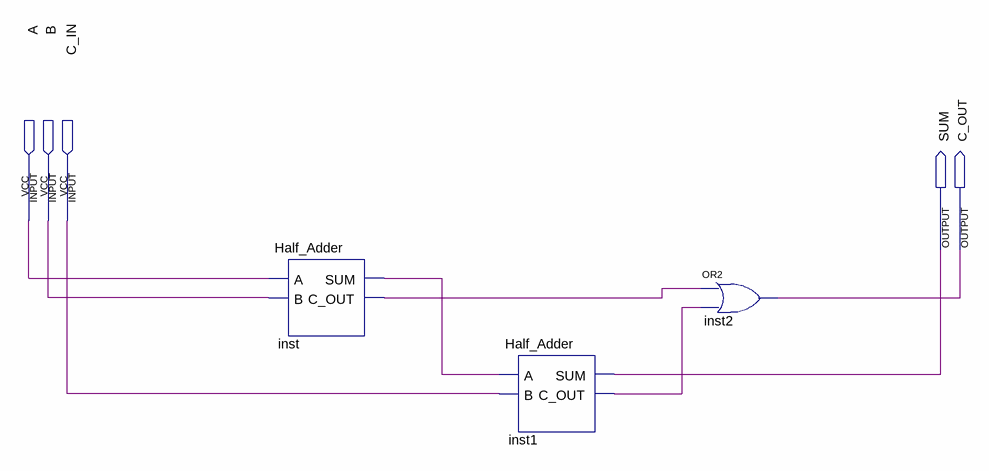
[diagram p0: schematic sheet]
// Quartus schematic Full_Adder.bdf as structural Verilog: 3 symbols, 5 pins
module Full_Adder (
  input  A,
  input  B,
  input  C_IN,
  output SUM,
  output C_OUT
);

  wire inst1_c_out, inst_c_out, inst_sum;

  Half_Adder inst (.A(A), .B(B), .SUM(inst_sum), .C_OUT(inst_c_out));
  Half_Adder inst1 (.A(inst_sum), .B(C_IN), .SUM(SUM), .C_OUT(inst1_c_out));
  or inst2 (C_OUT, inst_c_out, inst1_c_out);
endmodule
